# Altium schematic sheet Dots.SchDoc: Dot Segment
size A4; Address1: Smoka Wawelskiego 1; Address2: 30-535 Kraków, Poland; DocumentNumber: 7; Revision: v01; SheetNumber: 7; SheetTotal: 9; Author: Miroslaw Folejewski; CompanyName: Mirko Electronics; DrawnBy: Miroslaw Folejewski; Engineer: Miroslaw Folejewski; PageSetup: Record=PageOptions|CenterHorizontal=True|CenterVertical=True|PrintScale=1.00|XCorrection=1.00|YCorrection=1.00|PrintKind=0|BorderSize=5000000|LeftOffset=0|BottomOffset=0|Orientation=2|PaperLength=1000|PaperWidth=1000|Scale=100|PaperSource=7|PrintQuality=-4|MediaType=1|DitherType=10|PaperKind=A4|PrintScaleMode=1; PageSize: A4; Designators: -; ProjectName: 7-Segment LED Matrix Display
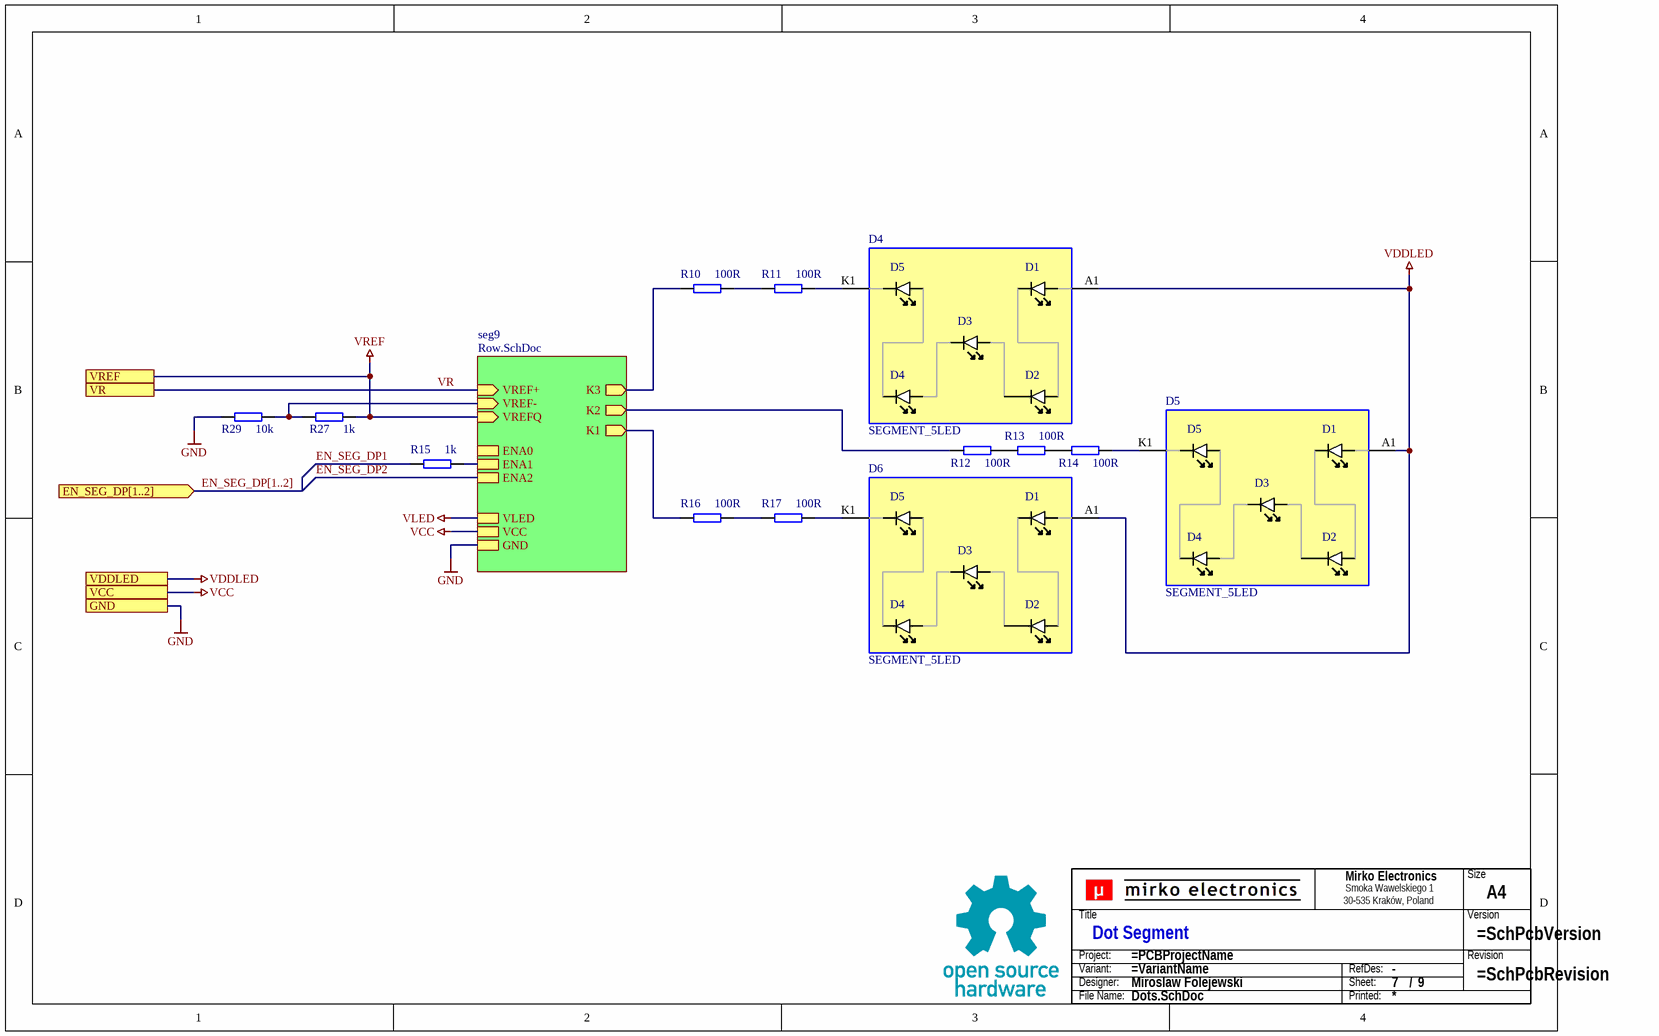
[diagram p0: Dots.SchDoc]

## Parts
?  (no value)  (graphical)
D4  SEGMENT_5LED  [SEGMENT_5LED_V]
D5  SEGMENT_5LED  [SEGMENT_5LED_V]
D6  SEGMENT_5LED  [SEGMENT_5LED_V]
R10  100R  [0805]
R11  100R  [0805]
R12  100R  [0805]
R13  100R  [0805]
R14  100R  [0805]
R15  1k  [0805]
R16  100R  [0805]
R17  100R  [0805]
R27  1k  [0805]
R29  10k  [0805]
TB?  Title block  (value not drawn)  (graphical)

## Sub-sheets
seg9 = Row.SchDoc: ENA0, VREF+ (in), VLED, VCC, GND, K1 (out), K2 (out), K3 (out), ENA1, ENA2, VREF- (in), VREFQ (in)

## Ports
EN_SEG_DP[1..2] (in), GND, VCC, VDDLED, VR, VREF

## Nets
GND: R29.1 ; port GND, sheet seg9/GND
VCC: port VCC, sheet seg9/VCC
VDDLED: D4.A1(VDD) D5.A1(VDD) D6.A1(VDD) ; port VDDLED
VLED: sheet seg9/VLED
VREF: R27.2 ; port VREF, sheet seg9/VREFQ
EN_SEG_DP1: R15.1
EN_SEG_DP2: sheet seg9/ENA2
VR: port VR, sheet seg9/VREF+
NetD4_K1: D4.K1(LED_R) R11.2
NetD5_K1: D5.K1(LED_R) R14.2
NetD6_K1: D6.K1(LED_R) R17.2
NetR10_1: R10.1 ; sheet seg9/K3
NetR10_2: R10.2 R11.1
NetR12_1: R12.1 ; sheet seg9/K2
NetR12_2: R12.2 R13.1
NetR13_2: R13.2 R14.1
NetR15_2: R15.2 ; sheet seg9/ENA1
NetR16_1: R16.1 ; sheet seg9/K1
NetR16_2: R16.2 R17.1
NetR27_1: R27.1 R29.2 ; sheet seg9/VREF-

## Buses and harness runs
bus EN_SEG_DP[1..2] = port EN_SEG_DP[1..2]

## Notes on the sheet
- Title
- Size
- Revision
- Checked By:
- Project:
- Variant:
- Engineer:
- Date:
- Sheet:
- /
- Designators
- Approved By:
- File:
- (in symbol SCH_TITLE_BLOCK_V1) Size; Title; Version; Project:; Revision; Variant:; RefDes:; Designer:; Sheet:; /; File Name:; Printed:
- (in symbol SEGMENT_5LED) D5; D1; D3; D2; D4

## Library data of the parts
? = Title Block NeoStrain
R10-R17 R27 R29 = R0805
TB? = SCH_TITLE_BLOCK_V1: Component Type: Title block; Manufacturer: -; Mounting Type: Non component; MPN: -; Operating Temperature: -; Package: -; Specification: Title block; Value: Title block; Replacement: -; System: ?